# Altium project over current protection.PrjPcb
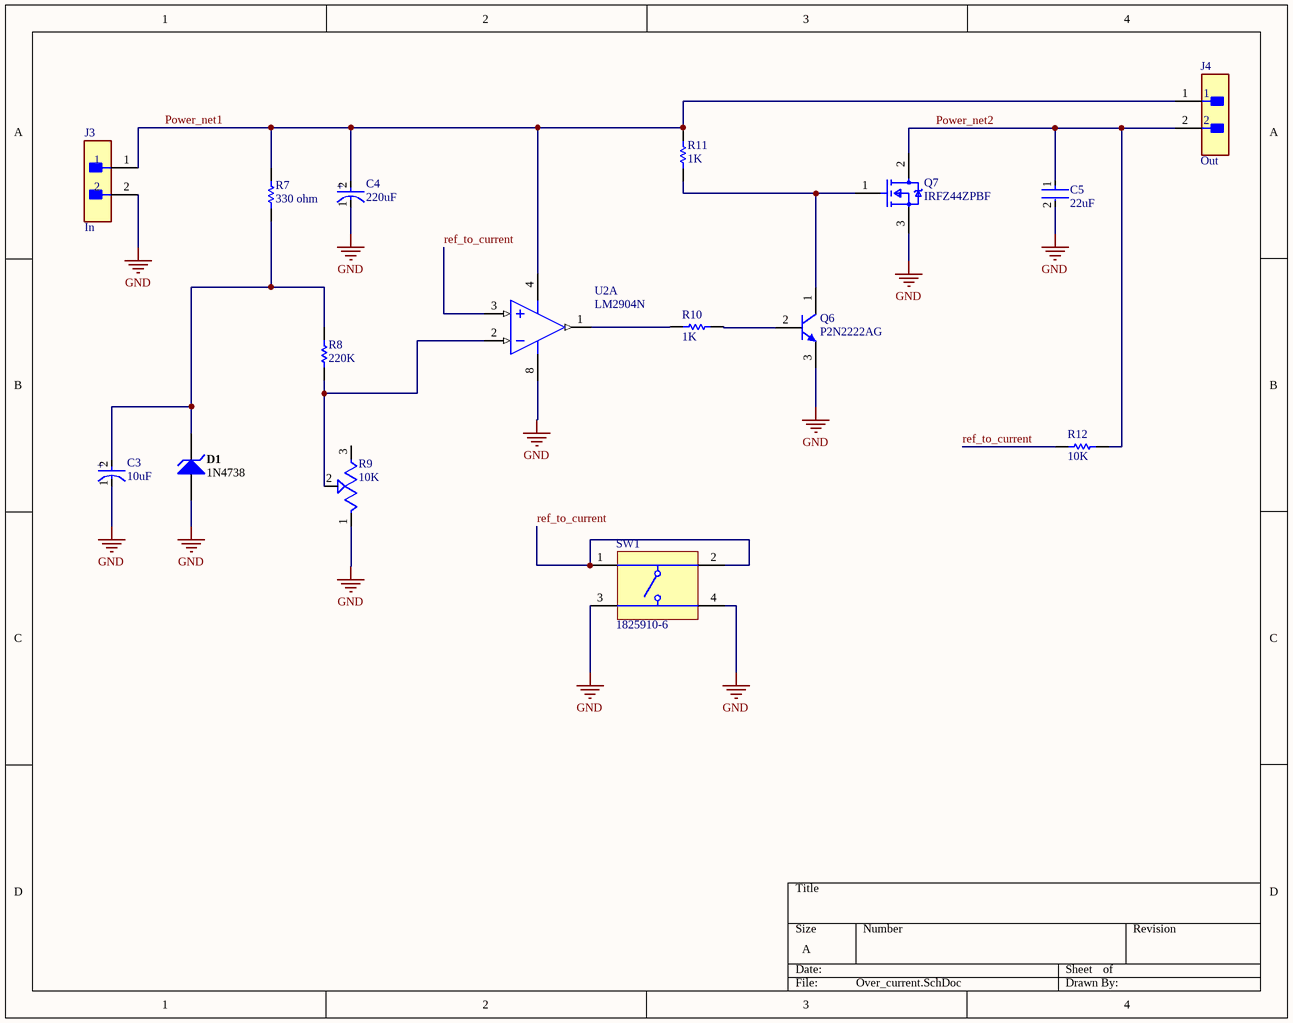
[diagram p0: Over_current.SchDoc]
1 sheet, 16 parts. Net scope: global (net labels, ports and power ports of the same name join across sheets).
Board file: Over_current.PcbDoc

## Sheet Over_current.SchDoc
size A; SheetNumber: 1; SheetTotal: 1

### Parts
C3  10uF  [FP-RAD-TH-D_10_0_5-L_20_2-MFG]
C4  220uF  [FP-RAD-TH-D_10_0_5-L_20_2-MFG]
C5  22uF  [FP-RCEWM1-MFG]
D1  1N4738  [FAIR-DO-41-2_V]
J3  In  [FP-B2B-XH-A_LF_SN-MFG]
J4  Out  [FP-B2B-XH-A_LF_SN-MFG]
Q6  P2N2222AG  [ONSC-TO-92-3-29-11]
Q7  IRFZ44ZPBF  [FP-PG-TO220-3-MFG]
R7  330 ohm  [OMTE-WLA-2_V2]
R8  220K  [OMTE-WLA-2_V2]
R9  10K  [TRIM_3306F-1-104]
R10  1K  [OMTE-WLA-2_V2]
R11  1K  [OMTE-WLA-2_V2]
R12  10K  [OMTE-WLA-2_V2]
SW1  1825910-6  [TECO-1825910-6_V]
U2  LM2904N  [ONSC-PDIP-8-626-05_M]  (part A of 2)

### Nets
GND: C3.1(C) C4.1(C) C5.2 D1.1(A) J3.2 Q6.3(E) Q7.3(S) R9.1(CCW) SW1.3 SW1.4 U2.8(VCC)
Power_net1: C4.2(A) J3.1 J4.1 R7.2 R11.1 U2.4(VEE/GND)
Power_net2: C5.1 J4.2 Q7.2(D) R12.1
ref_to_current: R12.2 SW1.1 SW1.2 U2.3(INA+)
NetC3_2: C3.2(A) D1.2(K) R7.1 R8.2
NetQ6_1: Q6.1(C) Q7.1(G) R11.2
NetQ6_2: Q6.2(B) R10.1
NetR8_1: R8.1 R9.2(W) U2.2(INA-)
NetR10_2: R10.2 U2.1(OUTA)

Not connected (* = marked no-connect by the designer): R9 3(CW)

### Notes on the sheet
- (in symbol CMP-05427-001613-1) +

### Library data of the parts
C3 C4 = CMP-05427-001613-1: Aluminum Electrolytic Capacitors (Radial Lead Type) 10uF ±20% 400V; Lead Diameter: 0.6mm; Life (Hours): 8000Hour; Ripple Current (AC): 300mA; Dissipation Factor: 0.24%; Dielectric Material: Aluminium; Polarity: Polar; Voltage: 400V; Number of Pins: 2; Height: 20mm; Case/Package: Radial; REACH SVHC: No SVHC; Max Operating Temperature: 105°C; Construction: RADIAL; Voltage Rating (DC): 400V; Tolerance: 20%; Voltage Rating: 400V; Contact Plating: Tin; Ripple Current: 300mA; Min Operating Temperature: -25°C; Packaging: Bulk; Lead Free: Lead Free; Diameter: 10mm; Height - Seated (Max): 0.787inch; Radiation Hardening: No; Capacitance: 10uF; Termination: Radial; Length: 20mm; Series: ED; Package Quantity: 200; Mount: Through Hole; Lead Pitch: 5mm; RoHS Compliant: Yes
C5 = CMP-06035-003622-1: CAP CER 22UF 25V X7R RADIAL; Tolerance: 20%; Lead Diameter: 0.5mm; Lead/Base Style: Formed Leads; Height - Seated (Max): 0.295inch; Height: 7.5mm; Capacitance: 22uF; Max Operating Temperature: 125°C; Package Quantity: 1500; Case/Package: Radial; Length: 0.217inch; Lead Pitch: 0.197inch; Voltage Rating (DC): 25V; Ratings: AEC-Q200; Mount: Through Hole; Packaging: Tape and Reel; Voltage Rating: 25V; Min Operating Temperature: -55°C; Width: 0.157inch; Resistor Type: Ceramic; Termination: Radial; Dielectric: X7R
D1 = CMP-0892-00030-1: Zener Diode, 4.7V, 1W, 5%, -65 to 200 degC, 2-Pin DO-41, Body 2.72 x 5.2 mm, RoHS; PartNumber: 1N4732A; Manufacturer: Fairchild Semiconductor; VZ (Min.) (V): 4.465; ZZ (Max) (ohm): 8; VZ (Max.) (V): 4.935; PD (W): 1; IR (uA): 10; Test Current IZ (mA): 53; DatasheetVersion: Rev. H3; ComponentLink3Description: Package Specification; PackageReference: DO-41-2; PackageVersion: Rev. 2; ComponentLink1Description: Manufacturer URL; Operating and Storage Temperature Range: -65 to 200 degC; PackageDescription: 2-Pin Axial leaded, Body 2.72 x 5.2 mm, Lead Spread 25.4 mm; ComponentLink2URL: http://www.fairchildsemi.com/ds/1N/1N4744A.pdf; Tolerance: 5%; ComponentLink2Description: Datasheet; Mounting Technology: Through Hole; RoHS: TRUE; ComponentLink3URL: http://www.fairchildsemi.com/dwg/DO/DO41A.pdf; ComponentLink1URL: http://www.fairchildsemi.com/
J3 J4 = CMP-2000-05888-3: CONN HEADER VERT 2POS 2.5MM; Current Rating: 3A; Voltage Rating: 250V; Number of Contacts: 2; Contact Resistance: 20mR; Wire/Cable Gauge: 22AWG; Insulation Resistance: 1GR; Connector Type: Male Pin; Packaging: Bulk; Contact Material: Brass; Lead Free: Lead Free; Orientation: Straight; Contact Plating: Tin; Max Current Rating: 3A; Termination: Solder; Fastening Type: Detent; Depth: 5.75mm; Housing Material: Polyamide; REACH SVHC: No SVHC; Series: XH; Voltage Rating (AC): 250V; Number of Positions: 2; Color: Natural; Contact Type: Male Pin; Max Voltage Rating (DC): 250V; Pitch: 2.5mm; Lead Pitch: 2.5mm; Mount: Through Hole; Max Operating Temperature: 85°C; Length: 7.4mm; Max Voltage Rating (AC): 250V; Min Operating Temperature: -25°C; Number of Rows: 1; Housing Color: White
Q6 = CMP-1048-01402-1: Amplifier Transistor, NPN Silicon, 3-Pin TO-92, Pb-Free, Bulk Box; Manufacturer: On Semiconductor; IC Continuous (A): 0.6; fT Min (MHz): 300; ComponentLink2Description: Datasheet; ComponentLink1Description: Manufacturer URL; ComponentLink2URL: http://www.onsemi.com/pub_link/Collateral/P2N2222A-D.PDF; ComponentLink3Description: Package Specification; RoHS: TRUE; ComponentLink1URL: http://www.onsemi.com/; PartNumber: P2N2222AG; Mounting Technology: Through Hole; PackageReference: TO-92-3-29-11_AM_SL; Polarity: NPN; Packing: Bulk Box; DatasheetVersion: Rev. 7; PackageDescription: 3-Pin Transistor Outline, Body 4.825 x 3.685 mm, Pitch 1.27 mm; PackageVersion: Rev. AM; ComponentLink3URL: http://www.onsemi.cn/pub_link/Collateral/2N6426-D.PDF
Q7 = CMP-32901-000501-1: MOSFET N-CH 55V 51A TO220AB; Drain to Source Resistance: 13.9mR; Gate to Source Voltage (Vgs): 20V; Input Capacitance: 1.42nF; Max Power Dissipation: 80W; Turn-Off Delay Time: 33ns; Turn-On Delay Time: 14ns; Threshold Voltage: 4V; Packaging: Rail/Tube; Halogen Free: Halogen Free; Lead Free: Lead Free; Min Operating Temperature: -55°C; Width: 0.19inch; Length: 0.42inch; Height: 0.38inch; Max Operating Temperature: 175°C; Drain to Source Voltage (Vdss): 55V; RoHS Compliant: Yes; Continuous Drain Current (ID): 51A; Max Dual Supply Voltage: 55V; Rds On Max: 13.9mR; Power Dissipation: 80W; Mount: Through Hole; REACH SVHC: No SVHC; Drain to Source Breakdown Voltage: 55V; Number of Pins: 3; Case/Package: TO-220
R7 R8 R10-R12 = CMP-1237-00001-1: Miniature Wirewound Current Sense, 0.02 Ohm +/-1%, 0.5 W, 2-Pin THD, RoHS, 25pc Pack; PartNumber: WLAR020FE; Manufacturer: Ohmite; Power Rating: 0.5 W; ComponentLink1URL: http://www.ohmite.com/; ComponentLink3URL: http://www.ohmite.com/cat/res_wl.pdf; DatasheetVersion: May-14; Rated Resistance: 0.02 Ohm; Resistance Tolerance: +/-1%; PackageDescription: 2-Pin Axial Lead, Body 5.08 x 2.54 mm, Lead Spread 25 mm; ComponentLink3Description: Package Specification; RoHS: TRUE; ComponentLink2URL: http://www.ohmite.com/cat/res_wl.pdf; Mounting Technology: Through Hole; Packing: 25pc Pack; ComponentLink2Description: Datasheet; ComponentLink1Description: Manufacturer URL
R9 = 3306F-1-104: 100 kOhms 0.2W, 1/5W PC Pins Through Hole Trimmer Potentiometer Cermet 1 Turn Top Adjustment; MF: Bourns; MP: 3306F-1-104; SnapEDA_Link: https://www.snapeda.com/parts/3306F-1-104/Bourns/view-part/372285/?ref=snap; Price: None; Package: 6432 Bourns; Availability: Unavailable; Value: *; Check_prices: https://www.snapeda.com/parts/3306F-1-104/Bourns/view-part/372285/?ref=eda
SW1 = CMP-1684-00021-1: Tact Switch, SPST-NO, 0.05 A, -35 to 85 degC, 4-Pin THD, RoHS, Bulk; Manufacturer: TE Connectivity; Maximum Contact Resistance: 100mOhm; Mechanical Life: 100000Cycles; Bushing Type: Unthreaded; Switch Configuration: OFF(ON); Maximum DC Voltage Rating: 24V; Contact Rating @ Voltage: 0.05A@24VDC; Actuator Color: Black; Body Orientation: Straight; Function: MomentaryContact; Illumination: N/R; Actuator Style: RoundButton; Actuator Material: PolybutyleneTerephthalate; Dielectric Strength: 500VAC; Pole Throw Configuration: SPST; Actuator Length: 1.4mm; Product Weight: N/A; Contact Material: CopperAlloy; Housing Material: N/A; Terminal Type: PCPins; Minimum Insulation Resistance: 100MOhm; Package Description: 4-Pin Through Hole Device, Body 5.99 x 5.99 mm, Pitch 6.5 mm; Part No: 1825910-6; Package Reference: THD; Base Material: N/A; Manufacturer URL: http://www.te.com; Contact Plating: Silver; RoHS: Yes; Datasheet Version: Rev. C9; Electrical Life: 100000Cycles; Maximum AC Voltage Rating: N/A; Thread Size: N/R; Operating Temperature: -35to85C; Mounting: ThroughHole; Dimension: 5.99x5mm; Datasheet URL: http://www.te.com/commerce/DocumentDelivery/DDEController?Action=showdoc&DocId=Customer+Drawing%7F1825910%7FC9%7Fpdf%7FEnglish%7FENG_CD_1825910_C9.pdf%7F1825910-6; Family: 1825910; Seal Location: N/A; Seal Description: N/A; Packaging: N/A
U2 = CMP-1310-00111-1: Single Supply Dual Operational Amplifier, 3 to 32 V, -40 to 105 degC, 8-Pin PDIP, Tube; Manufacturer: On Semiconductor; VCC Min (V): 3; VCC Max (V): 32; ComponentLink1URL: http://www.onsemi.com/; PackageReference: PDIP-8-626-05; PackageDescription: 8-Pin Plastic Dual-In Line Package, Body 9.52 x 6.605 mm, Pitch 2.54 mm; PackageVersion: Rev. M, 04/2010; DatasheetVersion: Rev. 27; RoHS: FALSE; ComponentLink2Description: Datasheet; ComponentLink3Description: Package Specification; ComponentLink2URL: http://www.onsemi.cn/pub_link/Collateral/LM358-D.PDF; PartNumber: LM2904N; ComponentLink3URL: http://www.onsemi.com/pub_link/Collateral/LM211-D.PDF; Packing: Tube; ComponentLink1Description: Manufacturer URL; Mounting Technology: Through Hole